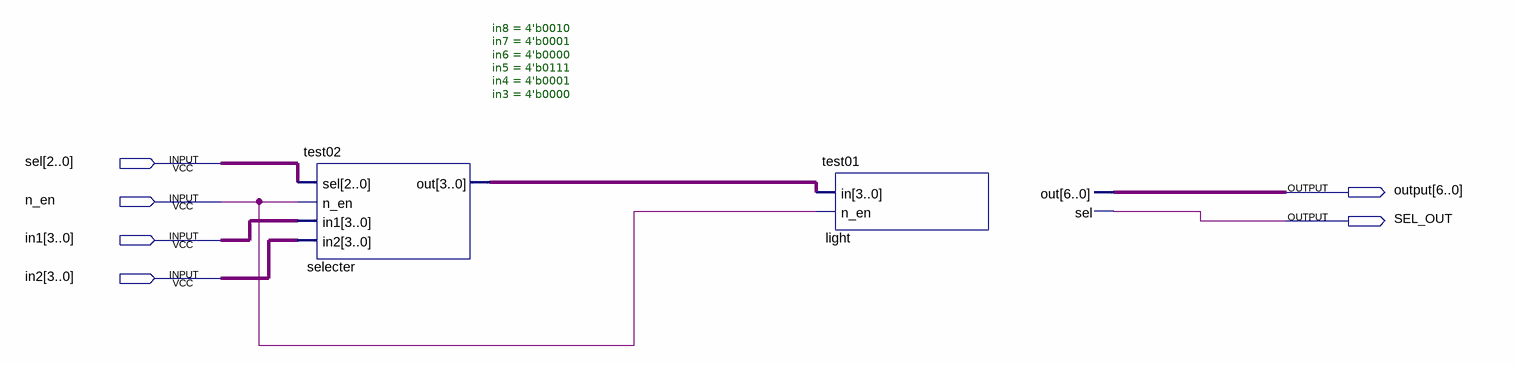
[diagram p0: schematic sheet]
// Quartus schematic exp1_extern.bdf as structural Verilog: 2 symbols, 6 pins
module exp1_extern (
  input  [2:0] sel,
  input  n_en,
  input  [3:0] in1,
  input  [3:0] in2,
  output [6:0] \output ,
  output SEL_OUT
);

  wire [3:0] selecter_out;

  test02 #(.in8(4'b0010), .in7(4'b0001), .in6(4'b0000), .in5(4'b0111), .in4(4'b0001), .in3(4'b0000)) selecter (
    .sel(sel), .n_en(n_en), .in1(in1), .in2(in2), .out(selecter_out));
  test01 light (.in(selecter_out), .n_en(n_en), .out(\output ), .sel(SEL_OUT));
endmodule
